# EAGLE design usb-drivver (EAGLE 9.6.2)
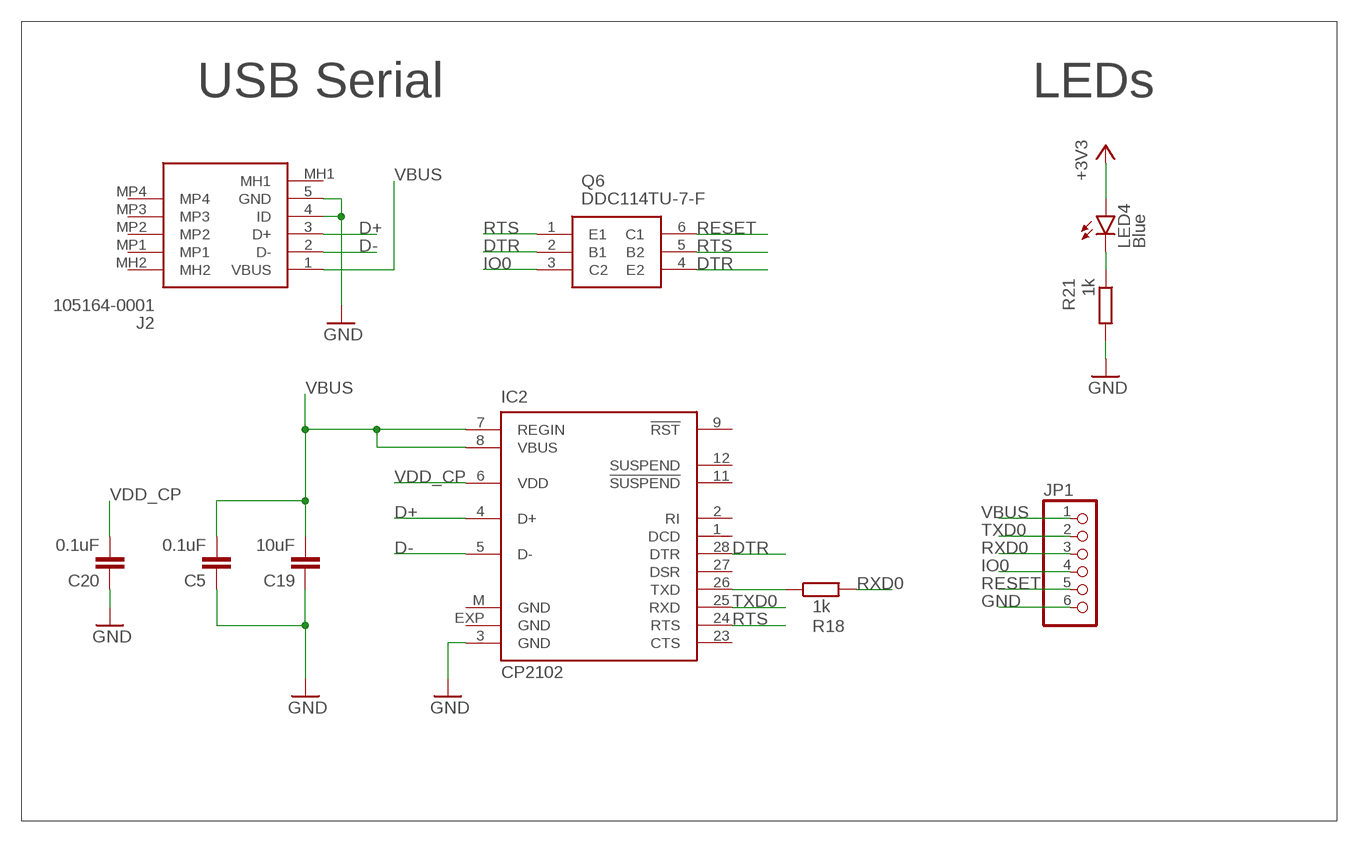
[diagram p0: schematic, sheet 1]

## Parts
C5  0.1uF  C-EUC0805  [C0805]
C19  10uF  C-EUC0805  [C0805]
C20  0.1uF  C-EUC0805  [C0805]
IC2  CP2102  [MLP28]
J2  105164-0001  [1051640001]
JP1  PINHD-1X6  [1X06]
LED4  Blue  LEDCHIP-LED0805  [CHIP-LED0805]
Q6  DDC114TU-7-F  [SOT65P210X110-6N]
R18  1k  R-EU_R0805  [R0805]
R21  1k  R-EU_R0805  [R0805]

## Nets
+3V3: LED4.A
D+: IC2.4(D+) J2.3(D+)
D-: IC2.5(D-) J2.2(D-)
DTR: IC2.28(DTR) Q6.2(B1) Q6.4(E2)
GND: C5.1 C19.1 C20.1 IC2.3(GND) J2.4(ID) J2.5(GND) JP1.6 R21.2
IO0: JP1.4 Q6.3(C2)
N$6: IC2.26(TXD) R18.1
N$14: LED4.C R21.1
RESET: JP1.5 Q6.6(C1)
RTS: IC2.24(RTS) Q6.1(E1) Q6.5(B2)
RXD0: JP1.3 R18.2
TXD0: IC2.25(RXD) JP1.2
VBUS: C5.2 C19.2 IC2.7(REGIN) IC2.8(VBUS) J2.1(VBUS) JP1.1
VDD_CP: C20.2 IC2.6(VDD)
Unconnected: IC2.1(DCD) IC2.2(RI) IC2.9(!RST) IC2.11(!SUSPEND) IC2.12(SUSPEND) IC2.23(CTS) IC2.27(DSR) J2.MH1 J2.MH2 J2.MP1 J2.MP2 J2.MP3 J2.MP4

## Notes on the sheet
- USB Serial | LEDs

## Power pins joined to a net without a drawn wire
GND: IC2.EXP(GND) IC2.M(GND)

## Library data of the parts
C5 C19 C20 = rcl:C-EU: CAPACITOR, European symbol; SPICEPREFIX: C
IC2 = silabs:CP210*: Single-Chip USB to UART Bridge Source: www.silabs.com .. CP2101.pdf / cp2102.pdf; MF: FARNELL; MPN: CP2102-GM; OC_FARNELL: 9282130; OC_NEWARK: 30K5635
J2 = SamacSys_Parts:105164-0001: USB - micro B USB 2.0 Receptacle Connector 5 Position Surface Mount, Right Angle; Through Hole Source: Datasheet <https://www.molex.com/pdm_docs/sd/1051640001_sd.pdf>; DESCRIPTION: USB - micro B USB 2.0 Receptacle Connector 5 Position Surface Mount, Right Angle; Through Hole; HEIGHT: 2.7mm; MANUFACTURER_NAME: Molex; MANUFACTURER_PART_NUMBER: 105164-0001; MOUSER_PART_NUMBER: 538-105164-0001; MOUSER_PRICE-STOCK: https://www.mouser.co.uk/ProductDetail/Molex/105164-0001?qs=JAwGc6FMfvtRY4SkW%2FoGcQ%3D%3D
JP1 = pinhead:PINHD-1X6: PIN HEADER
LED4 = led:LED: LED OSRAM: - CHIPLED LG R971, LG N971, LY N971, LG Q971, LY Q971, LO R971, LY R971 LH N974, LH R974 LS Q976, LO Q976, LY Q976 LO Q996 - Hyper CHIPLED LW Q18S LB Q993, LB Q99A, LB R99A - SideLED LS A670, LO A670, LY A670, LG A670, LP A670 LB A673, LV A673, LT A673, LW A673 LH A674 LY A675 LS A676, LA A676, LO A676, LY A676, LW A676 LS A679, LY A679, LG A679 - Hyper Micro SIDELED® LS Y876, LA Y876, LO Y876, LY Y876 LT Y87S - SmartLED LW L88C, LW L88S LB L89C, LB L89S, LG L890 LS L89K, LO L89K, LY L89K LS L896, LA L896, LO L896, LY L896 - TOPLED LS T670, LO T670, LY T670, LG T670, LP T670 LSG T670, LSP T670, LSY T670, LOP T670, LYG T670 LG T671, LOG T671, LSG T671 LB T673, LV T673, LT T673, LW T673 LH T674 LS T676, LA T676, LO T676, LY T676, LB T676, LH T676, LSB T676, LW T676 LB T67C, LV T67C, LT T67C, LS T67K, LO T67K, LY T67K, LW E67C LS E67B, LA E67B, LO E67B, LY E67B, LB E67C, LV E67C, LT E67C LW T67C LS T679, LY T679, LG T679 LS T770, LO T770, LY T770, LG T770, LP T770 LB T773, LV T773, LT T773, LW T773 LH T774 LS E675, LA E675, LY E675, LS T675 LS T776, LA T776, LO T776, LY T776, LB T776 LHGB T686 LT T68C, LB T68C - Hyper Mini TOPLED® LB M676 - Mini TOPLED Santana® LG M470 LS M47K, LO M47K, LY M47K Source: http://www.osram.convergy.de LUXEON: - LUMILED® LXK2-PW12-R00, LXK2-PW12-S00, LXK2-PW14-U00, LXK2-PW14-V00 LXK2-PM12-R00, LXK2-PM12-S00, LXK2-PM14-U00 LXK2-PE12-Q00, LXK2-PE12-R00, LXK2-PE12-S00, LXK2-PE14-T00, LXK2-PE14-U00 LXK2-PB12-K00, LXK2-PB12-L00, LXK2-PB12-M00, LXK2-PB14-N00, LXK2-PB14-P00, LXK2-PB14-Q00 LXK2-PR12-L00, LXK2-PR12-M00, LXK2-PR14-Q00, LXK2-PR14-R00 LXK2-PD12-Q00, LXK2-PD12-R00, LXK2-PD12-S00 LXK2-PH12-R00, LXK2-PH12-S00 LXK2-PL12-P00, LXK2-PL12-Q00, LXK2-PL12-R00 Source: www.luxeon.com KINGBRIGHT: KA-3528ASYC Source: www.kingbright.com
Q6 = SamacSys_Parts:DDC114TU-7-F: Bipolar Transistors - Pre-Biased DUAL NPN 200mW Source: Datasheet <https://www.diodes.com//assets/Datasheets/DDC_XXXX_U.pdf>; ARROW_PART_NUMBER: DDC114TU-7-F; ARROW_PRICE-STOCK: https://www.arrow.com/en/products/ddc114tu-7-f/diodes-incorporated?utm_currency=USD&region=nac; DESCRIPTION: Bipolar Transistors - Pre-Biased DUAL NPN 200mW; HEIGHT: 1.1mm; MANUFACTURER_NAME: Diodes Incorporated; MANUFACTURER_PART_NUMBER: DDC114TU-7-F; MOUSER_PART_NUMBER: 621-DDC114TU-F; MOUSER_PRICE-STOCK: https://www.mouser.co.uk/ProductDetail/Diodes-Incorporated/DDC114TU-7-F?qs=kw05dxSAXz1KFBQK0OZaZg%3D%3D
R18 R21 = rcl:R-EU_: RESISTOR, European symbol; SPICEPREFIX: R

## Net classes
0 VBAT: width 0.025 mm, clearance 0.205 mm
1 VBAT_Line: width 0.4 mm, clearance 0.205 mm

## Board
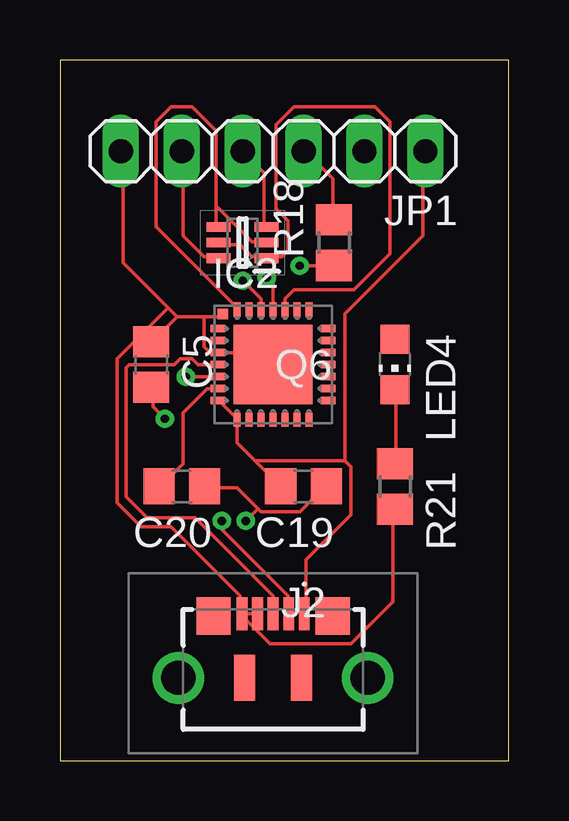
[diagram p1: board, top side]
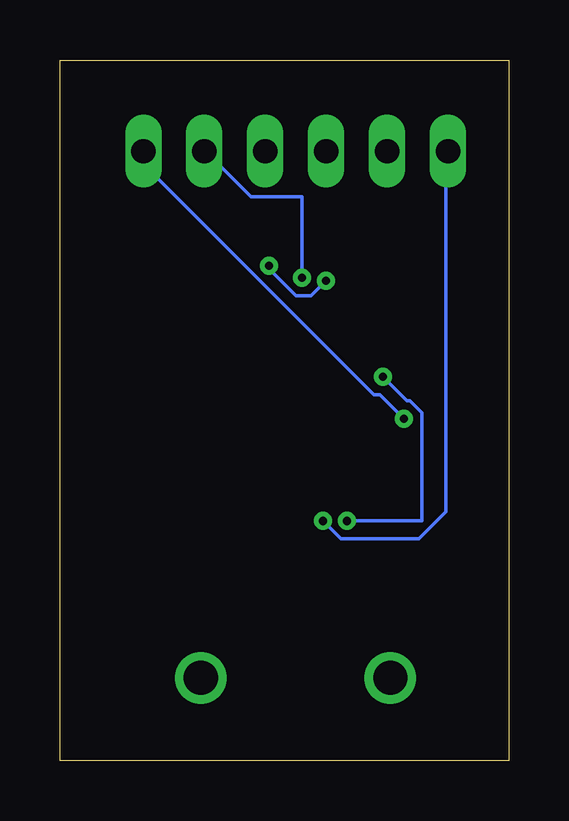
[diagram p2: board, bottom side, seen from below]

Size 18.72 x 29.2 mm. Coordinates in mm from the lower left corner, seen from the top.
Outline: 0,0 18.72,0 18.72,29.2 0,29.2 0,0
Copper layers (1*16): Top 0.035mm / dielectric 1.5mm / Bottom 0.035mm
Design rules "default": minimum track width 6mil, minimum drill 0.35mm, track to track 6mil, track to pad 6mil, pad to pad 6mil, via to via 6mil, smd to smd 6mil, copper to edge 40mil, drill to drill 6mil, minimum pad ring 10mil, minimum via ring 8mil, stop-mask expansion 4mil, vias tented up to drill 0mil, thermal gap 10mil

### Footprints (pad centres in the part's own frame; a part is rotated, then mirrored left to right if it is on the bottom)
C0805 = smd 1.3 x 1.5: 1 -0.95,0; 2 0.95,0
MLP28 = smd 0.6 x 0.3: 1 -2.3,1.5; 2 -2.3,1; 3 -2.3,0.5; 4 -2.3,0; 5 -2.3,-0.5; 6 -2.3,-1; 7 -2.3,-1.5; 15 2.3,-1.5; 16 2.3,-1; 17 2.3,-0.5; 18 2.3,0; 19 2.3,0.5; 20 2.3,1; 21 2.3,1.5 | smd 0.3 x 0.6: 8 -1.5,-2.3; 9 -1,-2.3; 10 -0.5,-2.3; 11 0,-2.3; 12 0.5,-2.3; 13 1,-2.3; 14 1.5,-2.3; 22 1.5,2.3; 23 1,2.3; 24 0.5,2.3; 25 0,2.3; 26 -0.5,2.3; 27 -1,2.3; 28 -1.5,2.3 | smd 3.3 x 3.3: EXP 0,0 | smd 0.435 x 0.435: M -2.103,2.103
1051640001 = smd 0.45 x 1.38: 1 -1.3,-2.31; 2 -0.65,-2.31; 3 0,-2.31; 4 0.65,-2.31; 5 1.3,-2.31 | drill 1.43 pad 2.145: MH1 -3.95,0.35; MH2 3.95,0.35 | smd 1.425 x 1.55: MP1 -2.487,-2.225; MP2 2.487,-2.225 | smd 0.875 x 1.9: MP3 -1.188,0.35; MP4 1.188,0.35
1X06 = drill 1.016 long: 1 -6.35,0; 2 -3.81,0; 3 -1.27,0; 4 1.27,0; 5 3.81,0; 6 6.35,0
CHIP-LED0805 = smd 1.2 x 1.2: A 0,-1.05; C 0,1.05
SOT65P210X110-6N = smd 1 x 0.4: 1 -1,0.65; 2 -1,0; 3 -1,-0.65; 4 1,-0.65; 5 1,0; 6 1,0.65
R0805 = smd 1.3 x 1.5: 1 -0.95,0; 2 0.95,0

### Placement (x,y rotation side)
C5  3.81,16.51 270 top
C19  10.16,11.43 180 top
C20  5.08,11.43 180 top
IC2  8.89,16.51 0 top
J2  8.89,3.81 180 top
JP1  8.89,25.4 180 top
LED4  13.97,16.51 180 top
Q6  7.62,21.59 180 top
R18  11.43,21.59 90 top
R21  13.97,11.43 270 top

### Tracks (layer width: path | path; a pad name or v marks a point on that pad's centre or on a via)
D+
  Top 0.152: IC2.4 6.5,16.5 5.75,16.5 5.5,16.75 5,16.75 4.75,16.5 2.88,16.5 2.75,16.38 2.75,11 3.62,10.12 5.62,10.12 8.88,6.88 8.88,6.12 J2.3
D-  (via drill 0.35)
  Top 0.152: v5.25,16 6.5,16 IC2.5 | v6.75,10 6.75,9.62 9.5,6.88 9.5,6.12 J2.2
  Bottom 0.152: v5.25,16 4.25,15 4.12,15 3.62,14.5 3.62,10 v6.75,10
DTR
  Top 0.152: 6.5,23.12 6.5,22.25 Q6.4 | 6.5,23.12 6.5,26.25 5.5,27.25 4.62,27.25 4,26.62 4,22.25 7.38,18.88 IC2.28 | 6.5,23.12 8,21.62 8.5,21.62 Q6.2
GND  (via drill 0.35)
  Top 0.152: J2.5 7.62,6.12 8.12,6.12 J2.4 | R21.2 13.88,10.38 13.88,6.62 12.12,4.88 8.75,4.88 7.62,6 J2.5 | 8.25,10.5 8.38,10.38 10,10.38 11,11.38 C19.1 | 8.25,10.5 7.38,11.38 6.12,11.38 C20.1 | 4.88,18.5 6,18.5 | 6,18.5 6.75,18.5 IC2.M | 4.88,18.5 3.88,17.5 C5.1 | IC2.EXP 8.88,16.62 8.5,17 6.62,17 IC2.3 6.5,17 6.25,17 6,17.25 6,18.5 | 4.88,18.5 4.5,18.88 | 4.5,18.88 2.62,20.75 2.62,25.38 JP1.6 | v7.75,10 8.25,10.5 | 4.5,18.88 2.38,16.75 2.38,10.75 3.38,9.75 4.62,9.75 7.5,6.88 7.5,6.12 J2.5
  Bottom 0.152: v7.75,10 7,9.25 3.75,9.25 2.62,10.38 2.62,25.38 JP1.6
IO0
  Top 0.152: Q6.3 8.5,22.25 8.5,24.5 7.62,25.38 JP1.4
N$6  (via drill 0.35)
  Top 0.152: v7.62,20 8.38,19.25 8.38,18.88 IC2.26 | v10,20.62 11.38,20.62 R18.1
  Bottom 0.152: v7.62,20 8.25,19.38 8.88,19.38 10,20.5 v10,20.62
N$14
  Top 0.152: LED4.C 14,15.38 14,12.5 R21.1
RESET
  Top 0.152: Q6.6 6.5,21 6,21 5.12,21.88 5.12,25.38 JP1.5
RTS
  Top 0.152: IC2.24 9.38,18.88 9.38,19.25 9.75,19.62 12.25,19.62 13.75,21.12 13.75,26.62 13.12,27.25 9.75,27.25 9,26.5 9,23 9.5,22.5 9.5,21.25 9.25,21 8.62,21 Q6.1 8.5,21 8,21 7.5,21.5 6.62,21.5 Q6.5
RXD0
  Top 0.152: R18.2 11.38,22.62 11.38,24.25 10.25,25.38 JP1.3
TXD0  (via drill 0.35)
  Top 0.152: v8.62,20.12 8.88,19.88 8.88,18.88 IC2.25
  Bottom 0.152: v8.62,20.12 8.62,23.5 10.75,23.5 12.62,25.38 JP1.2
VBUS  (via drill 0.35)
  Top 0.152: IC2.7 6.62,15 7.38,14.25 IC2.8 7.38,14.12 7.38,13.25 8.12,12.5 | 8.12,12.5 9.12,11.5 C19.2 | 11.88,12.5 12.12,12.25 12.12,10.25 10.25,8.38 10.25,6.12 J2.1 | 8.12,12.5 11.88,12.5 | v4.38,14.25 3.88,14.75 3.88,15.5 C5.2 | 11.88,12.5 11.88,18.62 15.12,21.88 15.12,25.38 JP1.1
  Bottom 0.152: v4.38,14.25 5.38,15.25 5.62,15.25 15.12,24.75 15.12,25.38 JP1.1
VDD_CP
  Top 0.152: IC2.6 6.5,15.5 6.12,15.5 5.12,14.5 5.12,12.38 4.25,11.5 C20.2